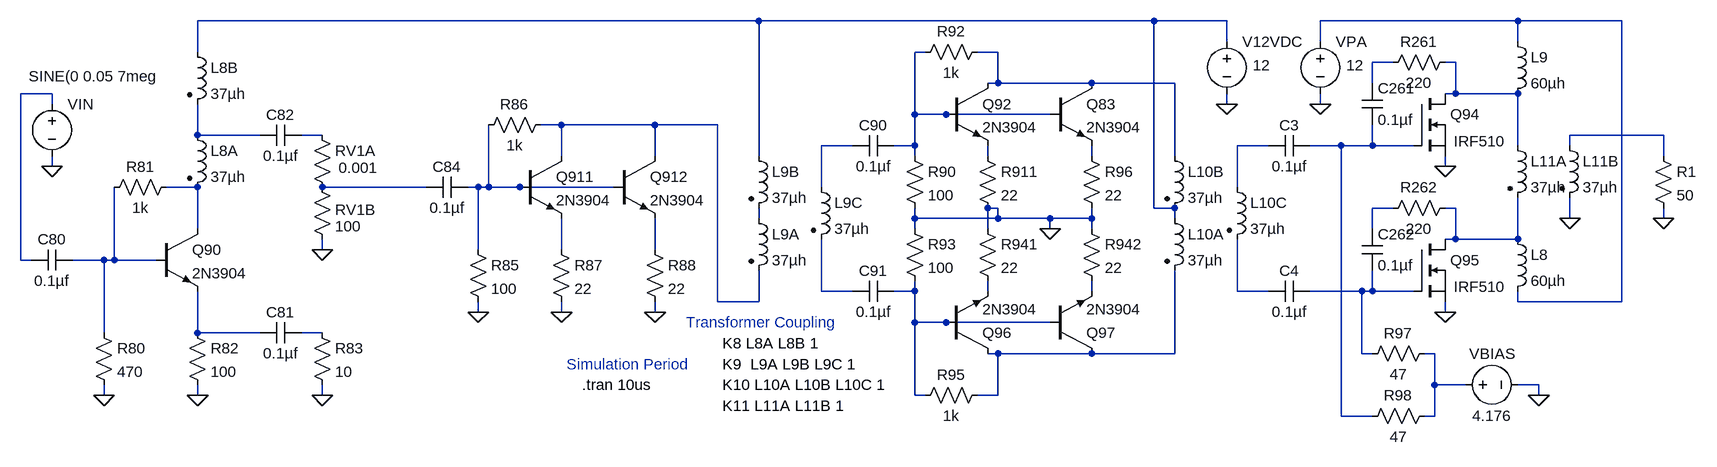
[diagram p0: schematic ubitx_pa.asc]
ubitx_pa.asc, the LTspice schematic file:
Version 4
SHEET 1 1912 680
WIRE 208 -224 -656 -224
WIRE 816 -224 208 -224
WIRE 928 -224 816 -224
WIRE 1376 -224 1072 -224
WIRE 1536 -224 1376 -224
WIRE 928 -192 928 -224
WIRE 1072 -192 1072 -224
WIRE 1376 -192 1376 -224
WIRE -656 -176 -656 -224
WIRE 464 -176 448 -176
WIRE 576 -176 544 -176
WIRE 1184 -160 1152 -160
WIRE 1280 -160 1264 -160
WIRE 576 -128 576 -176
WIRE 576 -128 560 -128
WIRE 720 -128 576 -128
WIRE 848 -128 720 -128
WIRE 1152 -128 1152 -160
WIRE -880 -112 -928 -112
WIRE 1280 -112 1280 -160
WIRE 1280 -112 1264 -112
WIRE 1376 -112 1280 -112
WIRE -880 -96 -880 -112
WIRE 928 -96 928 -112
WIRE 1072 -96 1072 -112
WIRE 448 -80 448 -176
WIRE 496 -80 448 -80
WIRE 656 -80 496 -80
WIRE -96 -64 -128 -64
WIRE 48 -64 -96 -64
WIRE 144 -64 48 -64
WIRE -656 -48 -656 -96
WIRE -560 -48 -656 -48
WIRE -464 -48 -496 -48
WIRE 1600 -48 1456 -48
WIRE 352 -32 304 -32
WIRE 448 -32 448 -80
WIRE 448 -32 416 -32
WIRE 992 -32 944 -32
WIRE 1104 -32 1056 -32
WIRE 1152 -32 1152 -64
WIRE 1152 -32 1104 -32
WIRE 1216 -32 1152 -32
WIRE 1376 -32 1376 -112
WIRE 1456 -32 1456 -48
WIRE -96 -16 -96 -64
WIRE 48 -16 48 -64
WIRE 208 -16 208 -224
WIRE 448 -16 448 -32
WIRE 560 -16 560 -32
WIRE 720 -16 720 -32
WIRE 848 -16 848 -128
WIRE 1600 -16 1600 -48
WIRE -880 0 -880 -16
WIRE 1264 0 1264 -16
WIRE -656 32 -704 32
WIRE -304 32 -464 32
WIRE -224 32 -240 32
WIRE -208 32 -208 -64
WIRE -208 32 -224 32
WIRE -160 32 -208 32
WIRE -16 32 -160 32
WIRE 304 32 304 -32
WIRE 944 32 944 -32
WIRE 576 64 560 64
WIRE 816 64 816 -224
WIRE 848 64 816 64
WIRE 1184 64 1152 64
WIRE 1280 64 1264 64
WIRE 208 80 208 64
WIRE 448 80 448 64
WIRE 576 80 576 64
WIRE 576 80 448 80
WIRE 656 80 576 80
WIRE 720 80 720 64
WIRE 720 80 656 80
WIRE 848 80 848 64
WIRE 1456 80 1456 48
WIRE 1600 80 1600 64
WIRE -656 96 -656 32
WIRE 448 96 448 80
WIRE 560 96 560 64
WIRE 656 96 656 80
WIRE 720 96 720 80
WIRE 1152 96 1152 64
WIRE 1280 112 1280 64
WIRE 1280 112 1264 112
WIRE 1376 112 1376 48
WIRE 1376 112 1280 112
WIRE -464 128 -464 112
WIRE -224 128 -224 32
WIRE -96 128 -96 80
WIRE 48 128 48 80
WIRE -928 144 -928 -112
WIRE -912 144 -928 144
WIRE -800 144 -848 144
WIRE -784 144 -784 32
WIRE -784 144 -800 144
WIRE -720 144 -784 144
WIRE 304 192 304 112
WIRE 352 192 304 192
WIRE 448 192 448 176
WIRE 448 192 416 192
WIRE 560 192 560 176
WIRE 720 192 720 176
WIRE 944 192 944 112
WIRE 992 192 944 192
WIRE 1136 192 1056 192
WIRE 1152 192 1152 160
WIRE 1152 192 1136 192
WIRE 1216 192 1152 192
WIRE 144 208 144 -64
WIRE 208 208 208 160
WIRE 208 208 144 208
WIRE 1376 208 1376 192
WIRE 1536 208 1536 -224
WIRE 1536 208 1376 208
WIRE -224 224 -224 208
WIRE -96 224 -96 208
WIRE 48 224 48 208
WIRE 1264 224 1264 208
WIRE 448 240 448 192
WIRE 496 240 448 240
WIRE 656 240 496 240
WIRE -800 256 -800 144
WIRE -656 256 -656 192
WIRE -560 256 -656 256
WIRE -464 256 -496 256
WIRE 576 288 560 288
WIRE 720 288 576 288
WIRE 848 288 848 160
WIRE 848 288 720 288
WIRE 1136 288 1136 192
WIRE 1152 288 1136 288
WIRE 1248 288 1232 288
WIRE 1248 336 1248 288
WIRE 1296 336 1248 336
WIRE 1408 336 1376 336
WIRE -800 352 -800 336
WIRE -656 352 -656 336
WIRE -464 352 -464 336
WIRE 448 352 448 240
WIRE 464 352 448 352
WIRE 576 352 576 288
WIRE 576 352 544 352
WIRE 1408 352 1408 336
WIRE 1104 384 1104 -32
WIRE 1152 384 1104 384
WIRE 1248 384 1248 336
WIRE 1248 384 1232 384
FLAG 1408 352 0
FLAG -96 224 0
FLAG -224 224 0
FLAG -464 352 0
FLAG -656 352 0
FLAG -800 352 0
FLAG -464 128 0
FLAG 1264 224 0
FLAG -880 0 0
FLAG 928 -96 0
FLAG 1456 80 0
FLAG 1600 80 0
FLAG 1264 0 0
FLAG 48 224 0
FLAG 656 96 0
FLAG 1072 -96 0
SYMBOL npn -720 96 R0
SYMATTR InstName Q90
SYMATTR Value 2N3904
SYMBOL npn -160 -16 R0
SYMATTR InstName Q911
SYMATTR Value 2N3904
SYMBOL nmos 1216 112 R0
WINDOW 3 61 73 Left 2
SYMATTR Value IRF510
SYMATTR InstName Q95
SYMBOL ind2 -672 -64 R0
SYMATTR InstName L8A
SYMATTR Value 37µh
SYMATTR Type ind
SYMBOL ind2 -672 -192 R0
SYMATTR InstName L8B
SYMATTR Value 37µh
SYMATTR Type ind
SYMBOL ind2 1360 -48 R0
SYMATTR InstName L11A
SYMATTR Value 37µh
SYMATTR Type ind
SYMBOL ind2 1440 -48 R0
SYMATTR InstName L11B
SYMATTR Value 37µh
SYMATTR Type ind
SYMBOL res -672 240 R0
SYMATTR InstName R82
SYMATTR Value 100
SYMBOL res -480 240 R0
SYMATTR InstName R83
SYMATTR Value 10
SYMBOL res -480 -64 R0
WINDOW 3 41 66 Left 2
SYMATTR Value 0.001
SYMATTR InstName RV1A
SYMBOL res -480 16 R0
WINDOW 0 36 51 Left 2
SYMATTR InstName RV1B
SYMATTR Value 100
SYMBOL res -688 16 R90
WINDOW 0 0 56 VBottom 2
WINDOW 3 32 56 VTop 2
SYMATTR InstName R81
SYMATTR Value 1k
SYMBOL res -816 240 R0
SYMATTR InstName R80
SYMATTR Value 470
SYMBOL res -112 -80 R90
WINDOW 0 0 56 VBottom 2
WINDOW 3 32 56 VTop 2
SYMATTR InstName R86
SYMATTR Value 1k
SYMBOL res -240 112 R0
SYMATTR InstName R85
SYMATTR Value 100
SYMBOL res -112 112 R0
SYMATTR InstName R87
SYMATTR Value 22
SYMBOL cap -560 272 R270
WINDOW 0 32 32 VTop 2
WINDOW 3 0 32 VBottom 2
SYMATTR InstName C81
SYMATTR Value 0.1µf
SYMBOL cap -848 128 R90
WINDOW 0 0 32 VBottom 2
WINDOW 3 32 32 VTop 2
SYMATTR InstName C80
SYMATTR Value 0.1µf
SYMBOL cap -496 -64 R90
WINDOW 0 0 32 VBottom 2
WINDOW 3 32 32 VTop 2
SYMATTR InstName C82
SYMATTR Value 0.1µf
SYMBOL cap -240 16 R90
WINDOW 0 0 32 VBottom 2
WINDOW 3 32 32 VTop 2
SYMATTR InstName C84
SYMATTR Value 0.1µf
SYMBOL voltage 928 -208 R0
WINDOW 3 40 52 Left 2
SYMATTR Value 12
SYMATTR InstName V12VDC
SYMBOL voltage -880 -112 R0
WINDOW 3 -36 -27 Left 2
WINDOW 39 35 44 Left 2
SYMATTR Value SINE(0 0.05 7meg
SYMATTR InstName VIN
SYMBOL voltage 1280 336 R270
WINDOW 0 32 56 VTop 2
WINDOW 3 -32 56 VBottom 2
WINDOW 123 0 0 Left 2
WINDOW 39 0 0 Left 2
SYMATTR InstName VBIAS
SYMATTR Value 4.176
SYMBOL res 1584 -32 R0
SYMATTR InstName R1
SYMATTR Value 50
SYMBOL nmos 1216 -112 R0
WINDOW 3 61 73 Left 2
SYMATTR Value IRF510
SYMATTR InstName Q94
SYMBOL ind 1360 -208 R0
SYMATTR InstName L9
SYMATTR Value 60µh
SYMBOL ind 1360 96 R0
SYMATTR InstName L8
SYMATTR Value 60µh
SYMBOL res 1248 368 R90
WINDOW 0 0 56 VBottom 2
WINDOW 3 32 56 VTop 2
SYMATTR InstName R98
SYMATTR Value 47
SYMBOL res 1248 272 R90
WINDOW 0 0 56 VBottom 2
WINDOW 3 32 56 VTop 2
SYMATTR InstName R97
SYMATTR Value 47
SYMBOL res 1280 -176 R90
WINDOW 0 0 56 VBottom 2
WINDOW 3 32 56 VTop 2
SYMATTR InstName R261
SYMATTR Value 220
SYMBOL res 1280 48 R90
WINDOW 0 0 56 VBottom 2
WINDOW 3 32 56 VTop 2
SYMATTR InstName R262
SYMATTR Value 220
SYMBOL cap 1136 -128 R0
SYMATTR InstName C261
SYMATTR Value 0.1µf
SYMBOL cap 1136 96 R0
SYMATTR InstName C262
SYMATTR Value 0.1µf
SYMBOL cap 1056 -48 R90
WINDOW 0 0 32 VBottom 2
WINDOW 3 32 32 VTop 2
SYMATTR InstName C3
SYMATTR Value 0.1µf
SYMBOL cap 1056 176 R90
WINDOW 0 0 32 VBottom 2
WINDOW 3 32 32 VTop 2
SYMATTR InstName C4
SYMATTR Value 0.1µf
SYMBOL ind2 928 16 R0
SYMATTR InstName L10C
SYMATTR Value 37µh
SYMATTR Type ind
SYMBOL ind2 832 -32 R0
SYMATTR InstName L10B
SYMATTR Value 37µh
SYMATTR Type ind
SYMBOL ind2 832 64 R0
SYMATTR InstName L10A
SYMATTR Value 37µh
SYMATTR Type ind
SYMBOL npn 656 -128 R0
SYMATTR InstName Q83
SYMATTR Value 2N3904
SYMBOL npn -16 -16 R0
SYMATTR InstName Q912
SYMATTR Value 2N3904
SYMBOL res 32 112 R0
SYMATTR InstName R88
SYMATTR Value 22
SYMBOL res 704 -32 R0
SYMATTR InstName R96
SYMATTR Value 22
SYMBOL res 704 80 R0
SYMATTR InstName R942
SYMATTR Value 22
SYMBOL npn 496 -128 R0
SYMATTR InstName Q92
SYMATTR Value 2N3904
SYMBOL res 544 -32 R0
SYMATTR InstName R911
SYMATTR Value 22
SYMBOL res 544 80 R0
SYMATTR InstName R941
SYMATTR Value 22
SYMBOL res 432 -32 R0
SYMATTR InstName R90
SYMATTR Value 100
SYMBOL res 432 80 R0
SYMATTR InstName R93
SYMATTR Value 100
SYMBOL npn 656 288 M180
SYMATTR InstName Q97
SYMATTR Value 2N3904
SYMBOL npn 496 288 M180
SYMATTR InstName Q96
SYMATTR Value 2N3904
SYMBOL res 560 -192 R90
WINDOW 0 0 56 VBottom 2
WINDOW 3 32 56 VTop 2
SYMATTR InstName R92
SYMATTR Value 1k
SYMBOL res 560 336 R90
WINDOW 0 0 56 VBottom 2
WINDOW 3 32 56 VTop 2
SYMATTR InstName R95
SYMATTR Value 1k
SYMBOL cap 416 -48 R90
WINDOW 0 0 32 VBottom 2
WINDOW 3 32 32 VTop 2
SYMATTR InstName C90
SYMATTR Value 0.1µf
SYMBOL cap 416 176 R90
WINDOW 0 0 32 VBottom 2
WINDOW 3 32 32 VTop 2
SYMATTR InstName C91
SYMATTR Value 0.1µf
SYMBOL ind2 288 16 R0
SYMATTR InstName L9C
SYMATTR Value 37µh
SYMATTR Type ind
SYMBOL ind2 192 -32 R0
SYMATTR InstName L9B
SYMATTR Value 37µh
SYMATTR Type ind
SYMBOL ind2 192 64 R0
SYMATTR InstName L9A
SYMATTR Value 37µh
SYMATTR Type ind
SYMBOL voltage 1072 -208 R0
WINDOW 3 40 52 Left 2
WINDOW 123 0 0 Left 2
WINDOW 39 0 0 Left 2
SYMATTR Value 12
SYMATTR InstName VPA
TEXT 152 272 Left 2 !K8 L8A L8B 1
TEXT 152 304 Left 2 !K9  L9A L9B L9C 1
TEXT 152 336 Left 2 !K10 L10A L10B L10C 1
TEXT -64 336 Left 2 !.tran 10us
TEXT 96 240 Left 2 ;Transformer Coupling
TEXT -88 304 Left 2 ;Simulation Period
TEXT 152 368 Left 2 !K11 L11A L11B 1

The netlist it stands for:
* ubitx_pa.asc
Q90 N017 N025 N032 0 2N3904
Q911 N008 N019 N023 0 2N3904
M§Q95 N021 N031 0 0 IRF510
L8A N009 N017 37µh
L8B N001 N009 37µh
L11A N006 N021 37µh
L11B N011 0 37µh
R82 N032 0 100
R83 N033 0 10
RV1A N010 N018 0.001
RV1B N018 0 100
R81 N017 N025 1k
R80 N025 0 470
R86 N008 N019 1k
R85 N019 0 100
R87 N023 0 22
C81 N032 N033 0.1µf
C80 N025 N007 0.1µf
C82 N010 N009 0.1µf
C84 N019 N018 0.1µf
V12VDC N001 0 12
VIN N007 0 SINE(0 0.05 7meg
VBIAS N035 0 4.176
R1 N011 0 50
M§Q94 N006 N014 0 0 IRF510
L9 N002 N006 60µh
L8 N021 N002 60µh
R98 N035 N014 47
R97 N035 N031 47
R261 N006 N005 220
R262 N021 N020 220
C261 N005 N014 0.1µf
C262 N020 N031 0.1µf
C3 N014 N013 0.1µf
C4 N031 N030 0.1µf
L10C N013 N030 37µh
L10B N004 N001 37µh
L10A N001 N034 37µh
Q83 N004 N003 N016 0 2N3904
Q912 N008 N019 N024 0 2N3904
R88 N024 0 22
R96 N016 0 22
R942 0 N029 22
Q92 N004 N003 N015 0 2N3904
R911 N015 0 22
R941 0 N028 22
R90 N003 0 100
R93 0 N027 100
Q97 N034 N027 N029 0 2N3904
Q96 N034 N027 N028 0 2N3904
R92 N004 N003 1k
R95 N034 N027 1k
C90 N003 N012 0.1µf
C91 N027 N026 0.1µf
L9C N012 N026 37µh
L9B N001 N022 37µh
L9A N022 N008 37µh
VPA N002 0 12
.model NPN NPN
.model PNP PNP
.lib standard.bjt
.model NMOS NMOS
.model PMOS PMOS
.lib standard.mos
K8 L8A L8B 1
K9  L9A L9B L9C 1
K10 L10A L10B L10C 1
.tran 10us
* Transformer Coupling
* Simulation Period
K11 L11A L11B 1
.backanno
.end